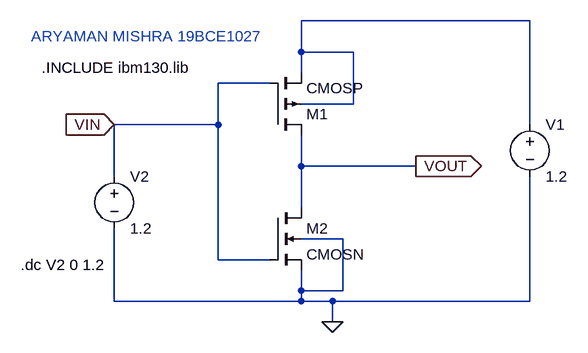
[diagram p0: schematic exp6_task4.asc]
exp6_task4.asc, the LTspice schematic file:
Version 4
SHEET 1 880 680
WIRE 576 -32 224 -32
WIRE 224 16 224 -32
WIRE 304 16 224 16
WIRE 224 48 224 16
WIRE 176 64 96 64
WIRE 304 96 304 16
WIRE 304 96 224 96
WIRE 96 128 96 64
WIRE 96 128 -64 128
WIRE 576 128 576 -32
WIRE 224 192 224 144
WIRE 400 192 224 192
WIRE -64 208 -64 128
WIRE 224 256 224 192
WIRE 288 304 224 304
WIRE 96 336 96 128
WIRE 176 336 96 336
WIRE 224 384 224 352
WIRE 288 384 288 304
WIRE 288 384 224 384
WIRE -64 400 -64 288
WIRE 224 400 224 384
WIRE 224 400 -64 400
WIRE 272 400 224 400
WIRE 576 400 576 208
WIRE 576 400 272 400
WIRE 272 432 272 400
FLAG -64 128 VIN
IOPIN -64 128 In
FLAG 400 192 VOUT
IOPIN 400 192 Out
FLAG 272 432 0
SYMBOL CMOSN 176 256 R0
SYMATTR InstName M2
SYMATTR Value2 l=130n w=300n
SYMBOL voltage 576 112 R0
WINDOW 123 0 0 Left 0
WINDOW 39 0 0 Left 0
SYMATTR InstName V1
SYMATTR Value 1.2
SYMBOL voltage -64 192 R0
WINDOW 123 0 0 Left 0
WINDOW 39 0 0 Left 0
SYMATTR InstName V2
SYMATTR Value 1.2
SYMBOL CMOSP 176 144 M180
SYMATTR InstName M1
SYMATTR Value2 l=130n w=1600n
TEXT -176 40 Left 2 !.INCLUDE ibm130.lib
TEXT -192 -8 Left 2 ;ARYAMAN MISHRA 19BCE1027
TEXT -208 344 Left 2 !.dc V2 0 1.2

The netlist it stands for:
* exp6_task4.asc
M2 VOUT VIN 0 0 CMOSN l=130n w=300n
V1 N001 0 1.2
V2 VIN 0 1.2
M1 VOUT VIN N001 N001 CMOSP l=130n w=1600n
.model NMOS NMOS
.model PMOS PMOS
.lib standard.mos
.INCLUDE ibm130.lib
* ARYAMAN MISHRA 19BCE1027
.dc V2 0 1.2
.backanno
.end

* Results of the author's LTspice run, read from the files saved beside the schematic
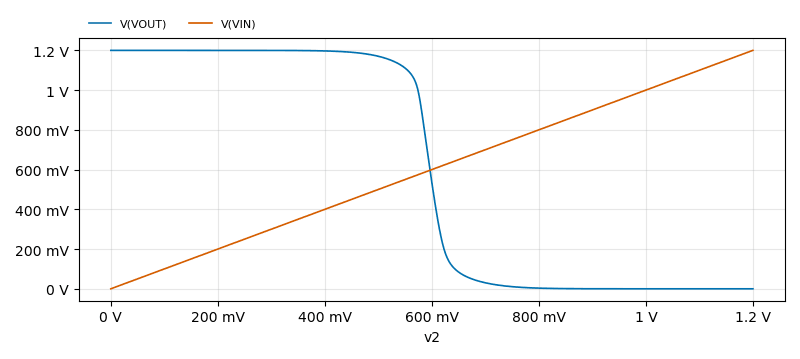
[diagram p1: DC transfer characteristic of exp6_task4.asc, plotted from the saved traces]
* DC transfer characteristic, 1 run:
*   V(VOUT): 1.2 V at v2=0 V, 31.98 nV at v2=1.2 V, min 31.98 nV, max 1.2 V
*   V(VIN): 0 V at v2=0 V, 1.2 V at v2=1.2 V, min 0 V, max 1.2 V